# EAGLE design IO Board (EAGLE 5.12)

## Sheet 1 of 4
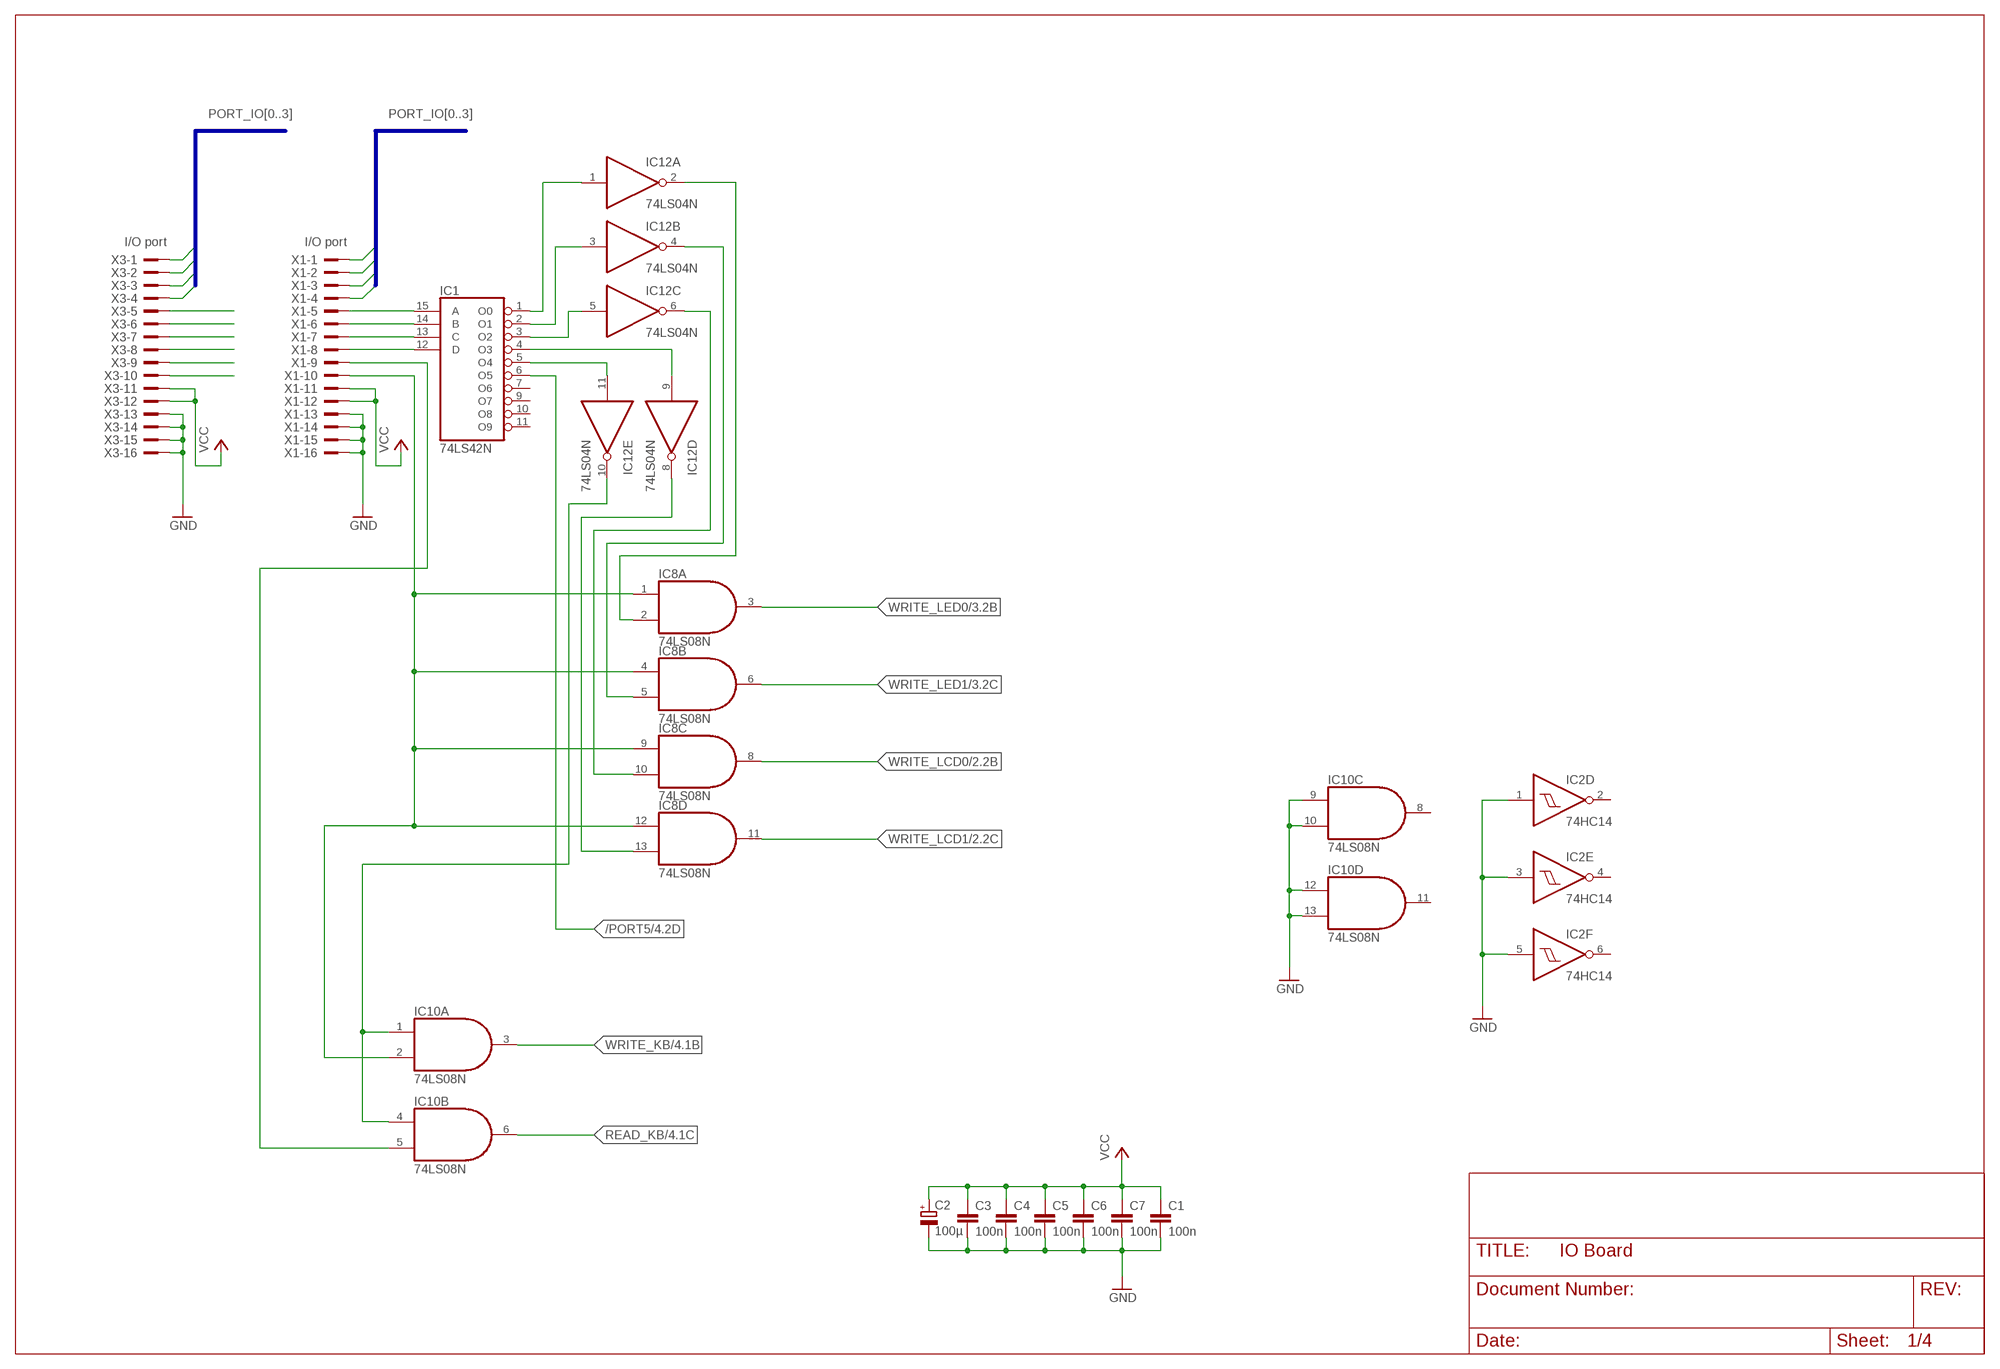
[diagram p0: schematic, sheet 1]

### Parts
C1  100n  C-EU050-025X075  [C050-025X075]
C2  100µ  CPOL-EUE2.5-6  [E2,5-6]
C3  100n  C-EU050-025X075  [C050-025X075]
C4  100n  C-EU050-025X075  [C050-025X075]
C5  100n  C-EU050-025X075  [C050-025X075]
C6  100n  C-EU050-025X075  [C050-025X075]
C7  100n  C-EU050-025X075  [C050-025X075]
IC1  74LS42N  [DIL16]
IC2  74HC14  74LS14N  [DIL14]
IC8  74LS08N  [DIL14]
IC10  74LS08N  [DIL14]
IC12  74LS04N  [DIL14]
X1  I/O port  2516-  [PAK100/2500-16]
X3  I/O port  2516-  [PAK100/2500-16]

### Nets
/PORT0: IC1.1(O0) IC12.1(A:I)
/PORT1: IC1.2(O1) IC12.3(B:I)
/PORT2: IC1.3(O2) IC12.5(C:I)
/PORT3: IC1.4(O3) IC12.9(D:I)
/PORT4: IC1.5(O4) IC12.11(E:I)
/PORT5: IC1.6(O5) ; also sheet 4
GND: C1.2 C2.- C3.2 C4.2 C5.2 C6.2 C7.2 IC2.1(D:I) IC2.3(E:I) IC2.5(F:I) IC10.9(C:I0) IC10.10(C:I1) IC10.12(D:I0) IC10.13(D:I1) X1.13 X1.14 X1.15 X1.16 X3.13 X3.14 X3.15 X3.16 ; also sheet 2,3,4
PORT0: IC8.2(A:I1) IC12.2(A:O)
PORT1: IC8.5(B:I1) IC12.4(B:O)
PORT2: IC8.10(C:I1) IC12.6(C:O)
PORT3: IC8.13(D:I1) IC12.8(D:O)
PORT4: IC10.1(A:I0) IC10.4(B:I0) IC12.10(E:O)
PORT_ADDR0: IC1.15(A) X1.5 X3.5
PORT_ADDR1: IC1.14(B) X1.6 X3.6
PORT_ADDR2: IC1.13(C) X1.7 X3.7
PORT_ADDR3: IC1.12(D) X1.8 X3.8
PORT_IO0: X1.1 X3.1 ; also sheet 2,3,4
PORT_IO1: X1.2 X3.2 ; also sheet 2,3,4
PORT_IO2: X1.3 X3.3 ; also sheet 2,3,4
PORT_IO3: X1.4 X3.4 ; also sheet 2,3,4
PORT_R: IC10.5(B:I1) X1.9 X3.9
PORT_W: IC8.1(A:I0) IC8.4(B:I0) IC8.9(C:I0) IC8.12(D:I0) IC10.2(A:I1) X1.10 X3.10
READ_KB: IC10.6(B:O) ; also sheet 4
VCC: C1.1 C2.+ C3.1 C4.1 C5.1 C6.1 C7.1 X1.11 X1.12 X3.11 X3.12 ; also sheet 2,3,4
WRITE_KB: IC10.3(A:O) ; also sheet 4
WRITE_LCD0: IC8.8(C:O) ; also sheet 2
WRITE_LCD1: IC8.11(D:O) ; also sheet 2
WRITE_LED0: IC8.3(A:O) ; also sheet 3
WRITE_LED1: IC8.6(B:O) ; also sheet 3
Unconnected: IC1.7(O6) IC1.9(O7) IC1.10(O8) IC1.11(O9) IC2.2(D:O) IC2.4(E:O) IC2.6(F:O) IC10.8(C:O) IC10.11(D:O)

### Buses
PORT_IO[0..3]

## Sheet 2 of 4
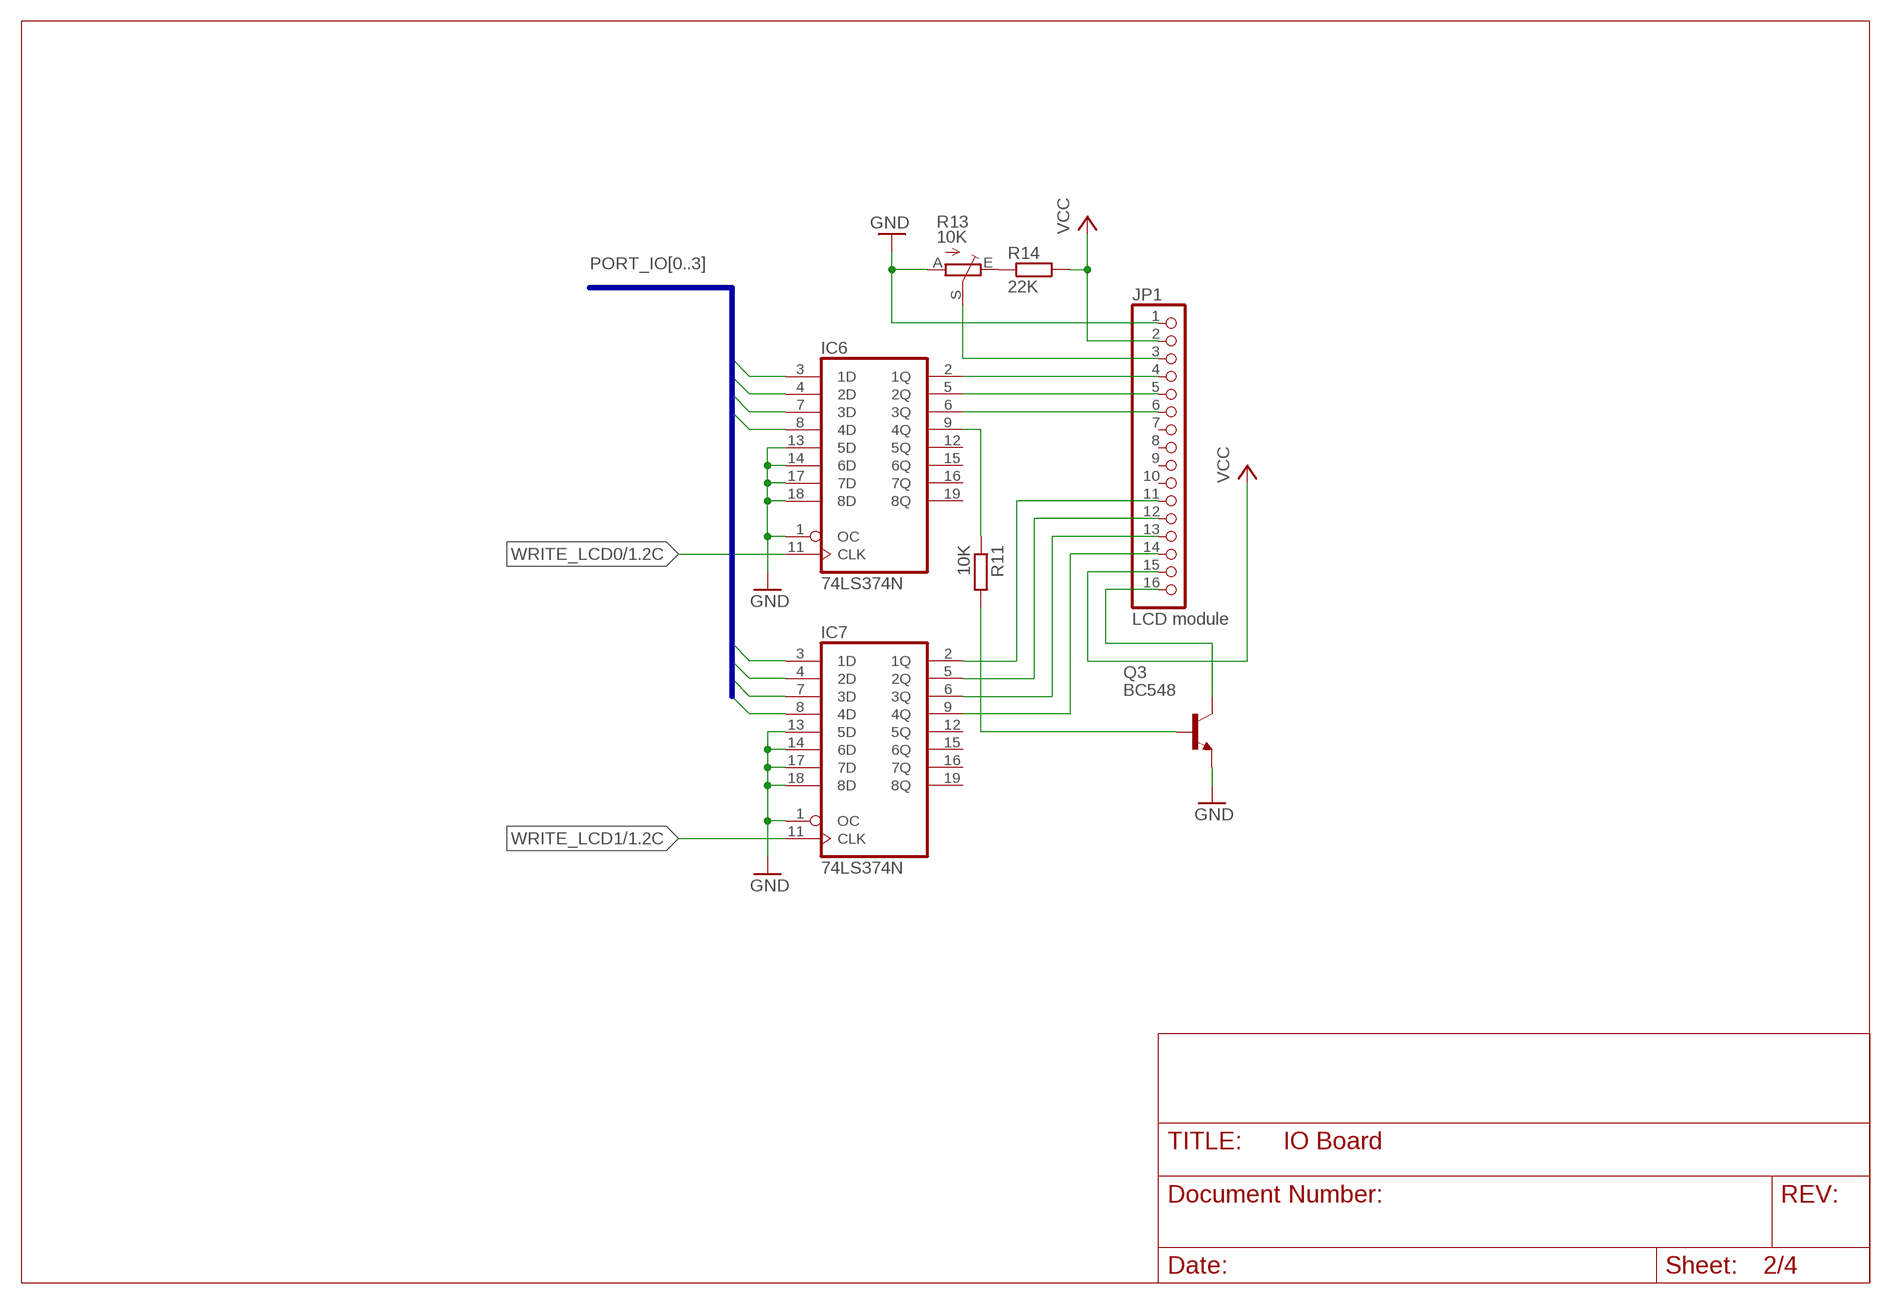
[diagram p1: schematic, sheet 2]

### Parts
IC6  74LS374N  [DIL20]
IC7  74LS374N  [DIL20]
JP1  LCD module  PINHD-1X16  [1X16]
Q3  BC548  [TO92-EBC]
R11  10K  R-EU_0207/10  [0207/10]
R13  10K  TRIM_EU-CA9V  [CA9V]
R14  22K  R-EU_0207/10  [0207/10]

### Nets
GND: IC6.1(OC) IC6.13(5D) IC6.14(6D) IC6.17(7D) IC6.18(8D) IC7.1(OC) IC7.13(5D) IC7.14(6D) IC7.17(7D) IC7.18(8D) JP1.1 Q3.E R13.A ; also sheet 1,3,4
LCD_CONTRAST: JP1.3 R13.S
LCD_D4: IC7.2(1Q) JP1.11
LCD_D5: IC7.5(2Q) JP1.12
LCD_D6: IC7.6(3Q) JP1.13
LCD_D7: IC7.9(4Q) JP1.14
LCD_E: IC6.6(3Q) JP1.6
LCD_RS: IC6.2(1Q) JP1.4
LCD_RW: IC6.5(2Q) JP1.5
N$11: R13.E R14.1
N$43: JP1.16 Q3.C
N$44: Q3.B R11.2
N$45: IC6.9(4Q) R11.1
PORT_IO0: IC6.3(1D) IC7.3(1D) ; also sheet 1,3,4
PORT_IO1: IC6.4(2D) IC7.4(2D) ; also sheet 1,3,4
PORT_IO2: IC6.7(3D) IC7.7(3D) ; also sheet 1,3,4
PORT_IO3: IC6.8(4D) IC7.8(4D) ; also sheet 1,3,4
VCC: JP1.2 JP1.15 R14.2 ; also sheet 1,3,4
WRITE_LCD0: IC6.11(CLK) ; also sheet 1
WRITE_LCD1: IC7.11(CLK) ; also sheet 1
Unconnected: IC6.12(5Q) IC6.15(6Q) IC6.16(7Q) IC6.19(8Q) IC7.12(5Q) IC7.15(6Q) IC7.16(7Q) IC7.19(8Q) JP1.7 JP1.8 JP1.9 JP1.10

### Buses
PORT_IO[0..3]

## Sheet 3 of 4
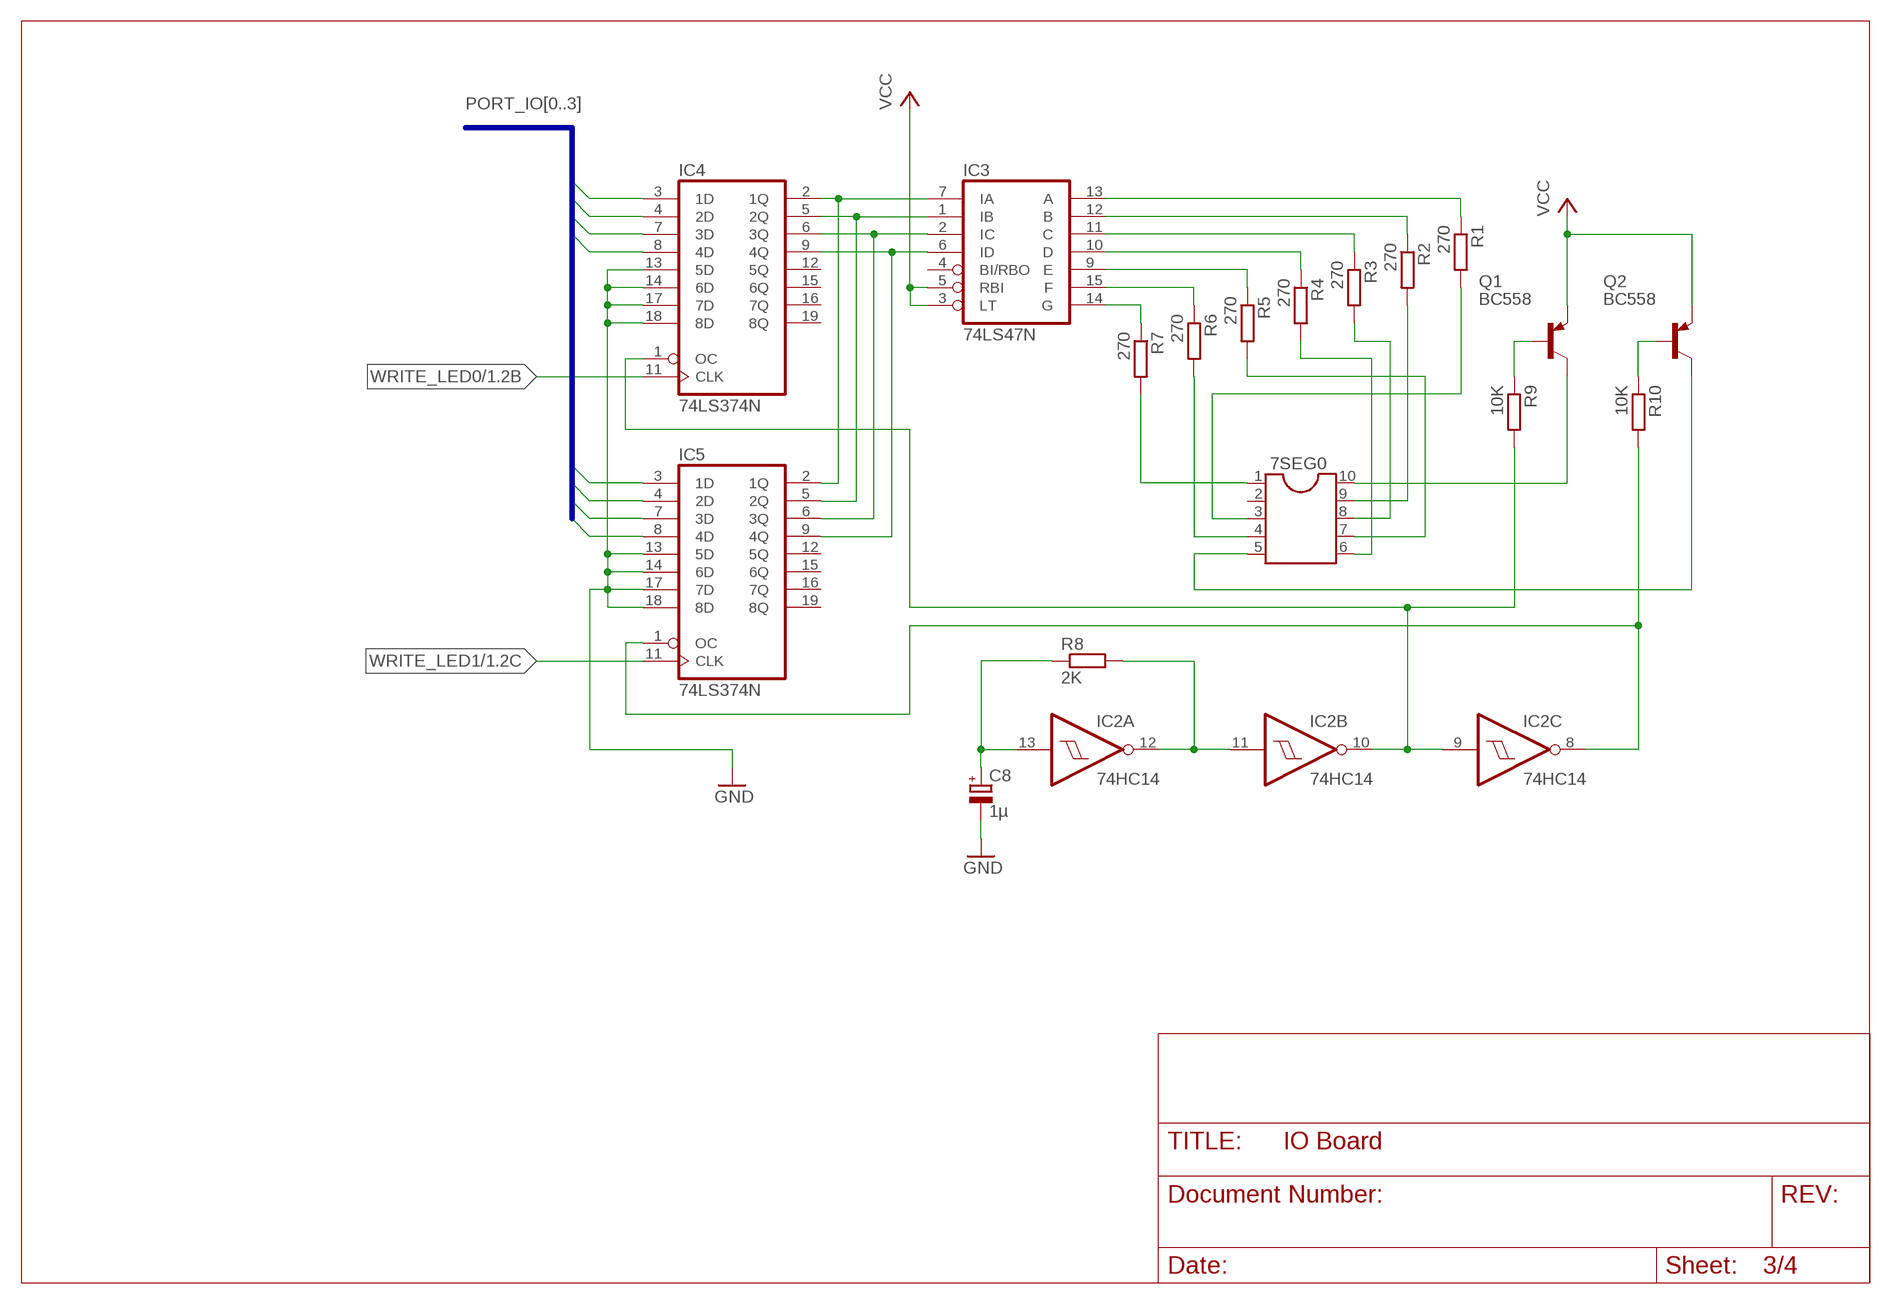
[diagram p2: schematic, sheet 3]

### Parts
7SEG0  DIL10  [DIL10]
C8  1µ  CPOL-EUE2.5-6  [E2,5-6]
IC3  74LS47N  [DIL16]
IC4  74LS374N  [DIL20]
IC5  74LS374N  [DIL20]
Q1  BC558  BC557  [TO92-EBC]
Q2  BC558  BC557  [TO92-EBC]
R1  270  R-EU_0207/10  [0207/10]
R2  270  R-EU_0207/10  [0207/10]
R3  270  R-EU_0207/10  [0207/10]
R4  270  R-EU_0207/10  [0207/10]
R5  270  R-EU_0207/10  [0207/10]
R6  270  R-EU_0207/10  [0207/10]
R7  270  R-EU_0207/10  [0207/10]
R8  2K  R-EU_0207/10  [0207/10]
R9  10K  R-EU_0207/10  [0207/10]
R10  10K  R-EU_0207/10  [0207/10]

### Nets
7SEG0: IC3.7(IA) IC4.2(1Q) IC5.2(1Q)
7SEG1: IC3.1(IB) IC4.5(2Q) IC5.5(2Q)
7SEG2: IC3.2(IC) IC4.6(3Q) IC5.6(3Q)
7SEG3: IC3.6(ID) IC4.9(4Q) IC5.9(4Q)
/EN_7SEG0: IC2.9(C:I) IC2.10(B:O) IC4.1(OC) R9.2
/EN_7SEG1: IC2.8(C:O) IC5.1(OC) R10.2
GND: C8.- IC4.13(5D) IC4.14(6D) IC4.17(7D) IC4.18(8D) IC5.13(5D) IC5.14(6D) IC5.17(7D) IC5.18(8D) ; also sheet 1,2,4
N$1: IC3.13(A) R1.1
N$2: IC3.12(B) R2.1
N$3: IC3.11(C) R3.1
N$4: IC3.10(D) R4.1
N$5: IC3.15(F) R6.1
N$6: IC3.14(G) R7.1
N$7: IC3.9(E) R5.1
N$8: IC2.11(B:I) IC2.12(A:O) R8.2
N$18: C8.+ IC2.13(A:I) R8.1
N$19: Q1.B R9.1
N$20: Q2.B R10.1
N$32: 7SEG0.10 Q1.C
N$33: 7SEG0.5 Q2.C
PORT_IO0: IC4.3(1D) IC5.3(1D) ; also sheet 1,2,4
PORT_IO1: IC4.4(2D) IC5.4(2D) ; also sheet 1,2,4
PORT_IO2: IC4.7(3D) IC5.7(3D) ; also sheet 1,2,4
PORT_IO3: IC4.8(4D) IC5.8(4D) ; also sheet 1,2,4
SEG_A: 7SEG0.3 R1.2
SEG_B: 7SEG0.9 R2.2
SEG_C: 7SEG0.8 R3.2
SEG_D: 7SEG0.6 R4.2
SEG_E: 7SEG0.7 R5.2
SEG_F: 7SEG0.4 R6.2
SEG_G: 7SEG0.1 R7.2
VCC: IC3.3(LT) IC3.5(RBI) Q1.E Q2.E ; also sheet 1,2,4
WRITE_LED0: IC4.11(CLK) ; also sheet 1
WRITE_LED1: IC5.11(CLK) ; also sheet 1
Unconnected: 7SEG0.2 IC3.4(BI/RBO) IC4.12(5Q) IC4.15(6Q) IC4.16(7Q) IC4.19(8Q) IC5.12(5Q) IC5.15(6Q) IC5.16(7Q) IC5.19(8Q)

### Buses
PORT_IO[0..3]

## Sheet 4 of 4
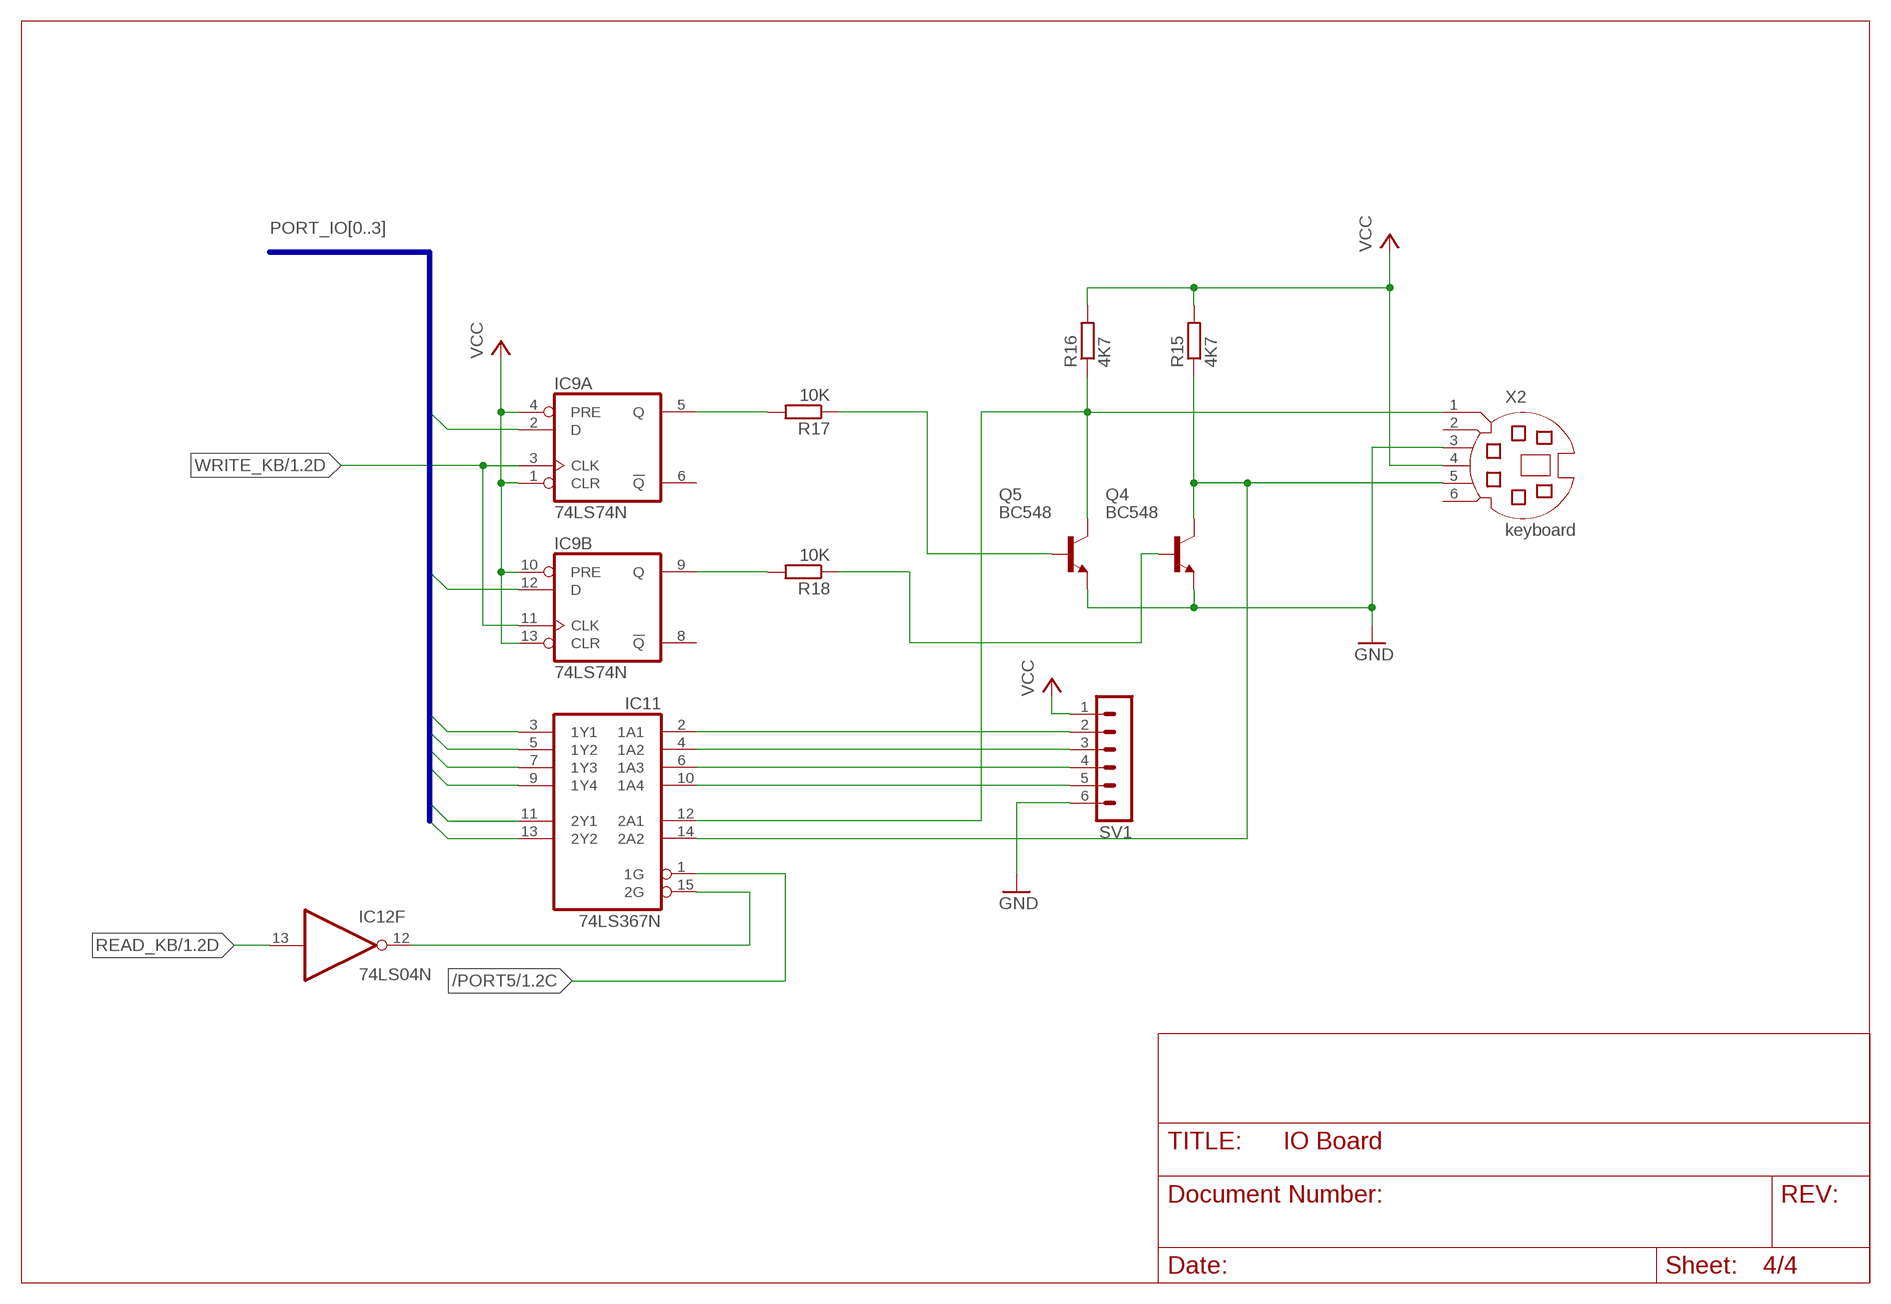
[diagram p3: schematic, sheet 4]

### Parts
IC9  74LS74N  [DIL14]
IC11  74LS367N  74367N  [DIL16]
Q4  BC548  [TO92-EBC]
Q5  BC548  [TO92-EBC]
R15  4K7  R-EU_0207/10  [0207/10]
R16  4K7  R-EU_0207/10  [0207/10]
R17  10K  R-EU_0207/10  [0207/10]
R18  10K  R-EU_0207/10  [0207/10]
SV1  MA06-1  [MA06-1]
X2  keyboard  MD06SS  [MDIN06SS]

### Nets
/PORT5: IC11.1(1G) ; also sheet 1
/READ_KB: IC11.15(2G) IC12.12(F:O)
GND: Q4.E Q5.E SV1.6 X2.3 ; also sheet 1,2,3
KB_CLK: IC11.14(2A2) Q4.C R15.1 X2.5
KB_DATA: IC11.12(2A1) Q5.C R16.1 X2.1
N$9: IC11.2(1A1) SV1.2
N$10: IC11.4(1A2) SV1.3
N$12: IC11.6(1A3) SV1.4
N$13: IC11.10(1A4) SV1.5
N$31: IC9.5(A:Q) R17.2
N$34: IC9.9(B:Q) R18.2
N$47: Q4.B R18.1
N$48: Q5.B R17.1
PORT_IO0: IC9.2(A:D) IC11.3(1Y1) IC11.11(2Y1) ; also sheet 1,2,3
PORT_IO1: IC9.12(B:D) IC11.5(1Y2) IC11.13(2Y2) ; also sheet 1,2,3
PORT_IO2: IC11.7(1Y3) ; also sheet 1,2,3
PORT_IO3: IC11.9(1Y4) ; also sheet 1,2,3
READ_KB: IC12.13(F:I) ; also sheet 1
VCC: IC9.1(A:CLR) IC9.4(A:PRE) IC9.10(B:PRE) IC9.13(B:CLR) R15.2 R16.2 SV1.1 X2.4 ; also sheet 1,2,3
WRITE_KB: IC9.3(A:CLK) IC9.11(B:CLK) ; also sheet 1
Unconnected: IC9.6(A:!Q) IC9.8(B:!Q) X2.2 X2.6

### Buses
PORT_IO[0..3]

## Power pins joined to a net without a drawn wire
GND: IC1.8(GND) IC2.7(P:GND) IC3.8(GND) IC4.10(GND) IC5.10(GND) IC6.10(GND) IC7.10(GND) IC8.7(P:GND) IC9.7(P:GND) IC10.7(P:GND) IC11.8(GND) IC12.7(P:GND)
VCC: IC1.16(VCC) IC2.14(P:VCC) IC3.16(VCC) IC4.20(VCC) IC5.20(VCC) IC6.20(VCC) IC7.20(VCC) IC8.14(P:VCC) IC9.14(P:VCC) IC10.14(P:VCC) IC11.16(VCC) IC12.14(P:VCC)

## Library data of the parts
7SEG0 = ic-package:DIL10: Dual In Line / Socket
C1 C3-C7 = rcl:C-EU: CAPACITOR, European symbol
C2 C8 = rcl:CPOL-EU: POLARIZED CAPACITOR, European symbol
IC1 = 74xx-us:74*42: 4-line to 10-line DECODER (1-of-10)
IC2 = 74xx-eu:74*14: Hex schmitt trigger INVERTER
IC3 = 74xx-us:74*47: BCD to seven segment DECODER/DRIVER Source: http://www.ee.washington.edu/stores/DataSheets/74ls/74ls47.pdf
IC4-IC7 = 74xx-us:74*374: Octal D type transparent LATCH, edge triggered
IC8 IC10 = 74xx-us:74*08: Quad 2-input AND gate
IC9 = 74xx-us:74*74: Dual D type positive edge triggered FLIP FLOP, preset and clear
IC11 = 74xx-us:74*367: Hex BUS DRIVER, 3-state
IC12 = 74xx-us:74*04: Hex INVERTER
JP1 = pinhead:PINHD-1X16: PIN HEADER
Q1 Q2 = transistor-pnp:BC557*: PNP Transistror
Q3-Q5 = transistor-npn:BC548*: NPN Transistor
R1-R11 R14-R18 = rcl:R-EU_: RESISTOR, European symbol
R13 = pot:TRIM_EU-: POTENTIOMETER
SV1 = con-lstb:MA06-1: PIN HEADER; OC_FARNELL: unknown; OC_NEWARK: unknown
X1 X3 = con-3m:2516-: 3M (TM) Pak 100 4-Wall Header Source: 3M; OC_FARNELL: unknown; OC_NEWARK: unknown
X2 = con-yamaichi:MD06SS: YAMAICHI CONNECTOR; OC_FARNELL: unknown; OC_NEWARK: unknown

## Board
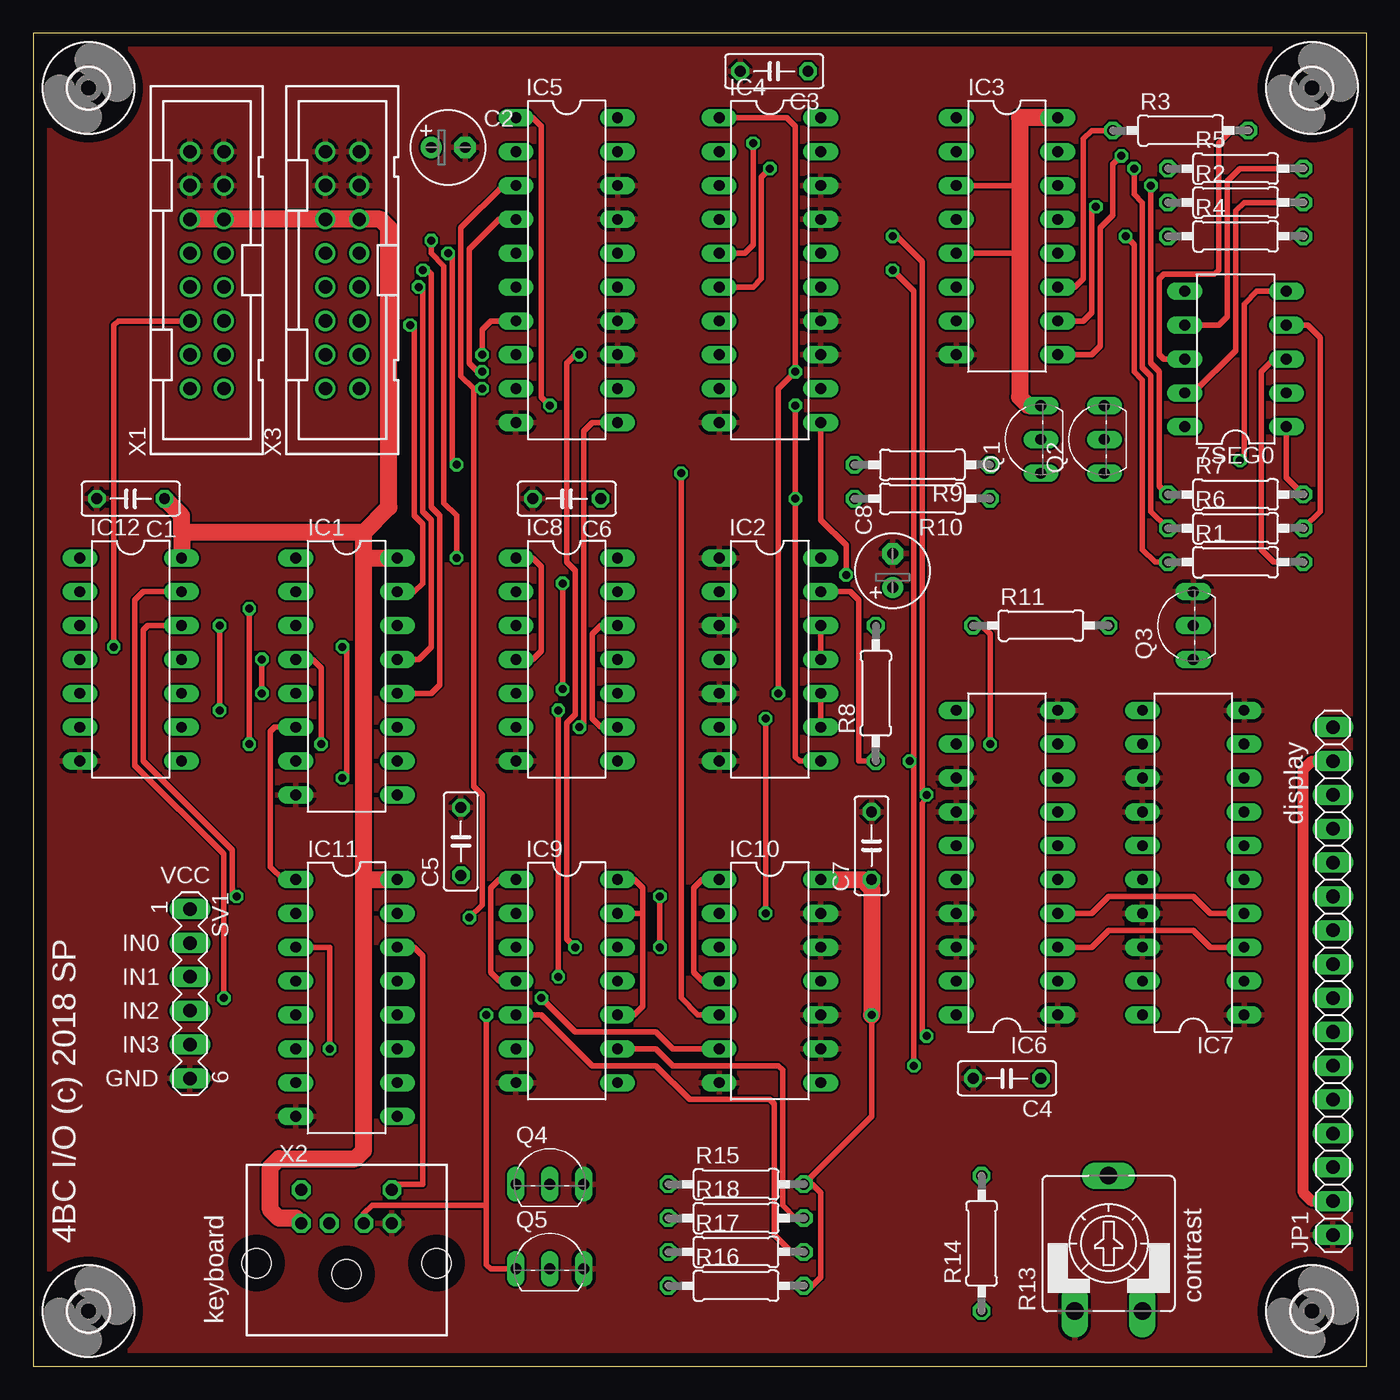
[diagram p4: board, top side]
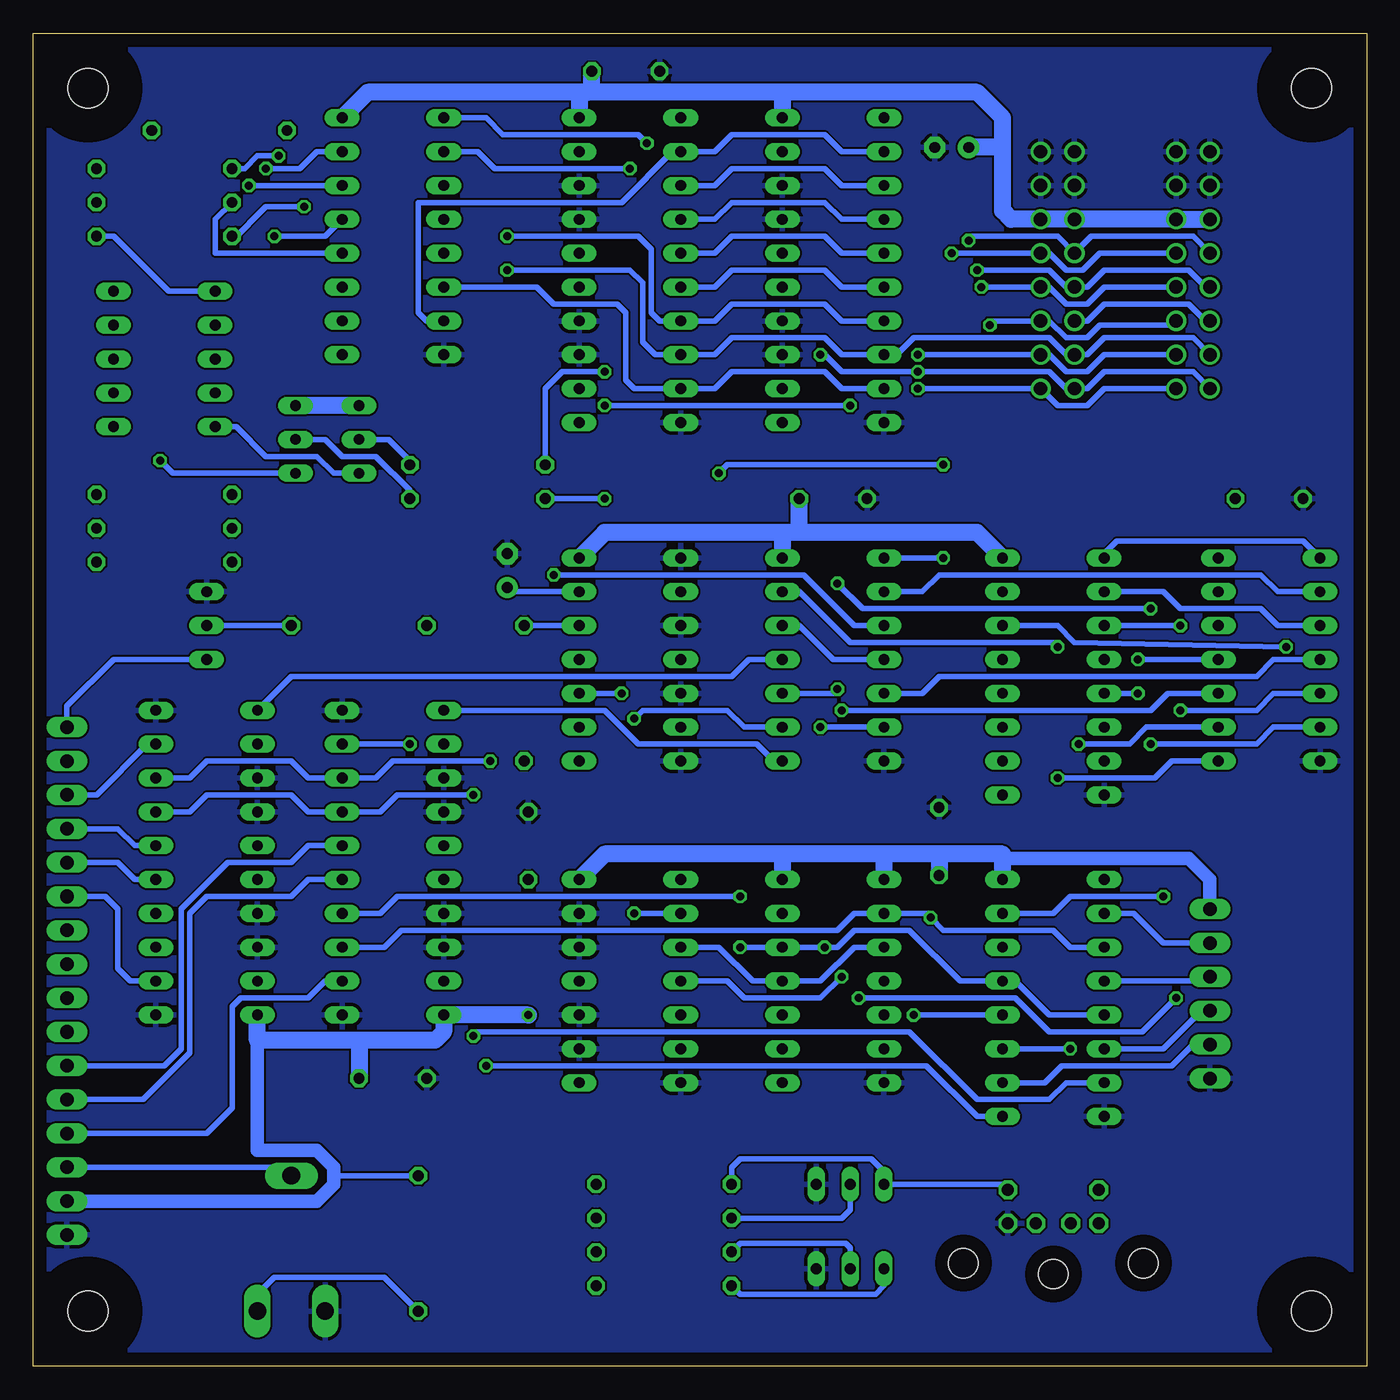
[diagram p5: board, bottom side, seen from below]

Size 99.99 x 100 mm. Coordinates in mm from the lower left corner, seen from the top.
Outline: 0,0 99.99,0 99.99,100 0,100 0,0
Copper layers (1*16): Top 0.035mm / dielectric 1.5mm / Bottom 0.035mm
Design rules "default *": minimum track width 10mil, minimum drill 16mil, track to track 6mil, track to pad 6mil, pad to pad 8mil, via to via 8mil, smd to smd 8mil, copper to edge 40mil, drill to drill 8mil, minimum pad ring 10mil, minimum via ring 8mil, stop-mask expansion 4mil, vias tented up to drill 0mil, thermal gap 10mil

### Footprints (pad centres in the part's own frame; a part is rotated, then mirrored left to right if it is on the bottom)
DIL10 = drill 0.813 long: 1 -5.08,-3.81; 2 -2.54,-3.81; 3 0,-3.81; 4 2.54,-3.81; 5 5.08,-3.81; 6 5.08,3.81; 7 2.54,3.81; 8 0,3.81; 9 -2.54,3.81; 10 -5.08,3.81
C050-025X075 = drill 0.813 octagon: 1 -2.54,0; 2 2.54,0
E2,5-6 = drill 0.813 pad 1.6 round: + -1.27,0 | drill 0.813 pad 1.6 octagon: - 1.27,0
DIL16 = drill 0.813 long: 1 -8.89,-3.81; 2 -6.35,-3.81; 3 -3.81,-3.81; 4 -1.27,-3.81; 5 1.27,-3.81; 6 3.81,-3.81; 7 6.35,-3.81; 8 8.89,-3.81; 9 8.89,3.81; 10 6.35,3.81; 11 3.81,3.81; 12 1.27,3.81; 13 -1.27,3.81; 14 -3.81,3.81; 15 -6.35,3.81; 16 -8.89,3.81
DIL14 = drill 0.813 long: 1 -7.62,-3.81; 2 -5.08,-3.81; 3 -2.54,-3.81; 4 0,-3.81; 5 2.54,-3.81; 6 5.08,-3.81; 7 7.62,-3.81; 8 7.62,3.81; 9 5.08,3.81; 10 2.54,3.81; 11 0,3.81; 12 -2.54,3.81; 13 -5.08,3.81; 14 -7.62,3.81
DIL20 = drill 0.813 long: 1 -11.43,-3.81; 2 -8.89,-3.81; 3 -6.35,-3.81; 4 -3.81,-3.81; 5 -1.27,-3.81; 6 1.27,-3.81; 7 3.81,-3.81; 8 6.35,-3.81; 9 8.89,-3.81; 10 11.43,-3.81; 11 11.43,3.81; 12 8.89,3.81; 13 6.35,3.81; 14 3.81,3.81; 15 1.27,3.81; 16 -1.27,3.81; 17 -3.81,3.81; 18 -6.35,3.81; 19 -8.89,3.81; 20 -11.43,3.81
1X16 = drill 1.016 long: 1 -19.05,0; 2 -16.51,0; 3 -13.97,0; 4 -11.43,0; 5 -8.89,0; 6 -6.35,0; 7 -3.81,0; 8 -1.27,0; 9 1.27,0; 10 3.81,0; 11 6.35,0; 12 8.89,0; 13 11.43,0; 14 13.97,0; 15 16.51,0; 16 19.05,0
TO92-EBC = drill 0.813 long: B 0,-1.27; C -2.54,-1.27; E 2.54,-1.27
0207/10 = drill 0.813 octagon: 1 -5.08,0; 2 5.08,0
CA9V = drill 1.321 long: A -2.54,-5.08; E 2.54,-5.08; S 0,5.08
MA06-1 = drill 1.016 long: 1 -6.35,0; 2 -3.81,0; 3 -1.27,0; 4 1.27,0; 5 3.81,0; 6 6.35,0
3,0 = hole 3: 0,0
PAK100/2500-16 = drill 1 pad 1.422 round: 1 -8.89,-1.27; 2 -8.89,1.27; 3 -6.35,-1.27; 4 -6.35,1.27; 5 -3.81,-1.27; 6 -3.81,1.27; 7 -1.27,-1.27; 8 -1.27,1.27; 9 1.27,-1.27; 10 1.27,1.27; 11 3.81,-1.27; 12 3.81,1.27; 13 6.35,-1.27; 14 6.35,1.27; 15 8.89,-1.27; 16 8.89,1.27
MDIN06SS = drill 0.9 octagon: 1 1.3,8.5; 2 -1.3,8.5; 3 3.4,8.5; 4 -3.4,8.5; 5 3.4,11; 6 -3.4,11 | hole 2.2: -6.75,5.5; 0,4.7; 6.75,5.5

### Placement (x,y rotation side)
7SEG0  90.17,75.56 90 top
C1  7.3,65.09 180 top
C2  31.11,91.44 0 top
C3  55.56,97.16 180 top
C4  73.03,21.59 180 top
C5  32.07,39.37 90 top
C6  40.01,65.09 180 top
C7  62.87,39.05 90 top
C8  64.45,59.69 90 top
IC1  23.5,51.75 270 top
IC2  55.24,53.02 270 top
IC3  73.03,84.77 270 top
IC4  55.24,82.23 270 top
IC5  40.01,82.23 270 top
IC6  73.03,37.78 90 top
IC7  87,37.78 90 top
IC8  40.01,53.02 270 top
IC9  40.01,28.89 270 top
IC10  55.24,28.89 270 top
IC11  23.5,27.62 270 top
IC12  7.3,53.02 270 top
JP1  97.47,28.89 90 top
Q1  74.3,69.53 90 top
Q2  79.06,69.53 90 top
Q3  85.72,55.56 90 top
Q4  38.73,14.92 0 top
Q5  38.73,8.57 0 top
R1  90.17,60.33 0 top
R2  90.17,87.31 0 top
R3  86.04,92.71 0 top
R4  90.17,84.77 0 top
R5  90.17,89.85 0 top
R6  90.17,62.87 0 top
R7  90.17,65.41 0 top
R8  63.18,50.48 90 top
R9  66.67,67.63 180 top
R10  66.67,65.09 180 top
R11  75.56,55.56 0 top
R13  80.64,9.21 0 top
R14  71.12,9.21 90 top
R15  52.7,13.65 0 top
R16  52.7,6.03 0 top
R17  52.7,8.57 0 top
R18  52.7,11.11 0 top
SV1  11.75,27.94 270 top
U$1  [3,0]  4.13,95.89 0 top
U$2  [3,0]  4.13,4.13 0 top
U$3  [3,0]  95.89,95.89 0 top
U$4  [3,0]  95.89,4.13 0 top
X1  13.02,82.23 90 top
X2  23.5,2.22 0 top
X3  23.18,82.23 90 top

### Tracks (layer width: path | path; a pad name or v marks a point on that pad's centre or on a via)
7SEG0
  Bottom 0.406: IC5.2 39.37,91.12 40.64,92.39 47.62,92.39 48.9,91.12 IC4.2 52.07,91.12 55.88,87.31 71.12,87.31 71.12,79.06 70.48,78.42 IC3.7
7SEG1  (via drill 0.6)
  Top 0.406: v53.98,91.76 53.98,84.14 53.34,83.5 IC4.5
  Bottom 0.406: IC5.5 39.37,83.5 40.64,84.77 47.62,84.77 48.9,83.5 IC4.5 | IC3.1 66.04,93.66 64.77,92.39 54.61,92.39 v53.98,91.76
7SEG2  (via drill 0.6)
  Top 0.406: v55.24,89.85 54.61,89.22 54.61,81.6 53.98,80.96 IC4.6
  Bottom 0.406: IC4.6 48.9,80.96 47.62,82.23 40.64,82.23 39.37,80.96 IC5.6 | IC3.2 66.67,91.12 65.41,89.85 v55.24,89.85
7SEG3
  Bottom 0.406: IC5.9 39.37,73.34 40.64,74.61 47.62,74.61 48.9,73.34 IC4.9 54.93,73.34 55.56,73.98 55.56,79.06 56.2,79.69 60.96,79.69 62.23,80.96 IC3.6
/EN_7SEG0  (via drill 0.6)
  Top 0.406: IC2.9 IC2.10 | v55.88,50.48 55.88,73.34 v57.15,74.61 57.15,93.03 56.52,93.66 IC4.1
  Bottom 0.406: v57.15,74.61 60.33,74.61 61.59,73.34 R9.2 | IC2.10 v55.88,50.48
/EN_7SEG1  (via drill 0.6)
  Top 0.406: IC5.1 37.47,93.66 38.1,93.03 38.1,72.71 v38.73,72.07 | IC2.8 57.47,45.4 57.15,45.72 v57.15,65.09 v57.15,72.07
  Bottom 0.406: v57.15,72.07 v38.73,72.07 | v57.15,65.09 R10.2
/PORT0
  Bottom 0.406: IC1.1 19.68,60.96 18.73,61.91 4.76,61.91 IC12.1
/PORT1
  Bottom 0.406: IC1.2 15.24,58.1 13.97,56.83 7.94,56.83 6.67,55.56 IC12.3
/PORT2  (via drill 0.6)
  Top 0.406: v13.97,49.21 v13.97,55.56
  Bottom 0.406: v13.97,55.56 IC1.3 | v13.97,49.21 8.26,49.21 6.99,50.48 IC12.5
/PORT3  (via drill 0.6)
  Top 0.406: v21.59,46.67 21.59,52.39 20.95,53.02 IC1.4
  Bottom 0.406: IC12.9 16.51,47.94 17.78,46.67 v21.59,46.67
/PORT4  (via drill 0.6)
  Top 0.406: v17.14,53.02 v17.14,50.48
  Bottom 0.406: v17.14,50.48 IC1.5 | IC12.11 v17.14,53.02
/PORT5
  Top 0.406: IC11.1 18.73,36.51 17.78,37.47 17.78,47.62 18.1,47.94 IC1.6
/READ_KB  (via drill 0.6)
  Top 0.406: v15.24,35.24 14.92,35.56 14.92,38.73 8.26,45.4 8.26,55.24 8.57,55.56 IC12.12
  Bottom 0.406: IC11.15 23.5,33.97 22.23,35.24 v15.24,35.24
GND
  pour Bottom: 0,100.01 100.65,100.01 100.65,0 0,0
  pour Top: 0,100.01 100.65,100.01 100.65,0 0,0
KB_CLK
  Top 0.406: IC11.14 28.57,31.43 29.21,30.8 29.21,13.65 27.32,13.65 X2.5
  Bottom 0.406: R15.1 47.62,14.92 46.99,15.56 37.15,15.56 36.2,14.61 Q4.C 27.32,13.65 X2.5
KB_DATA  (via drill 0.6)
  Top 0.406: 33.97,12.06 33.97,7.62 34.29,7.3 Q5.C | 33.97,12.06 v33.97,26.35 | X2.1 24.8,11.46 25.4,12.06 33.97,12.06
  Bottom 0.406: R16.1 46.99,5.4 36.83,5.4 36.2,6.03 Q5.C | v33.97,26.35 IC11.12
LCD_CONTRAST
  Bottom 0.406: JP1.3 81.28,14.92 R13.S
LCD_D4
  Bottom 0.406: JP1.11 94.61,35.24 93.66,34.29 93.66,29.84 92.71,28.89 IC7.2
LCD_D5
  Bottom 0.406: IC7.5 92.39,36.51 93.66,37.78 JP1.12
LCD_D6
  Bottom 0.406: IC7.6 92.39,39.05 93.66,40.32 JP1.13
LCD_D7
  Bottom 0.406: JP1.14 95.25,42.86 91.44,46.67 IC7.9
LCD_E
  Bottom 0.406: IC6.6 79.38,39.05 80.64,37.78 85.41,37.78 88.9,34.29 88.9,23.81 90.17,22.54 JP1.6
LCD_RS
  Bottom 0.406: IC6.2 78.11,28.89 79.38,27.62 84.45,27.62 85.09,26.99 85.09,19.37 87,17.46 JP1.4
LCD_RW
  Bottom 0.406: JP1.5 91.76,20 88.27,23.5 88.27,33.97 87,35.24 80.64,35.24 79.38,36.51 IC6.5
N$1  (via drill 0.6)
  Top 0.406: R1.1 84.14,60.33 83.19,61.28 83.19,73.98 82.55,74.61 82.55,84.14 v81.92,84.77
  Bottom 0.406: v81.92,84.77 78.11,84.77 IC3.13
N$2
  Bottom 0.406: IC3.12 86.36,83.5 86.36,86.04 R2.1
N$3
  Top 0.406: R3.1 79.38,92.71 78.74,92.08 78.74,81.6 78.11,80.96 IC3.11
N$4  (via drill 0.6)
  Top 0.406: v79.69,87 79.38,86.68 79.38,79.06 78.74,78.42 IC3.10
  Bottom 0.406: v79.69,87 82.55,87 85.09,84.45 R4.1
N$5  (via drill 0.6)
  Top 0.406: R6.1 83.82,64.14 83.82,74.3 83.19,74.93 83.19,87.31 82.55,87.95 v82.55,89.85
  Bottom 0.406: v82.55,89.85 80.01,89.85 78.74,91.12 IC3.15
N$6  (via drill 0.6)
  Top 0.406: R7.1 84.45,66.04 84.45,74.61 83.82,75.25 v83.82,88.58
  Bottom 0.406: v83.82,88.58 IC3.14
N$7  (via drill 0.6)
  Top 0.406: IC3.9 79.38,75.88 80.01,76.52 80.01,85.41 80.96,86.36 80.96,90.17 v81.6,90.81
  Bottom 0.406: v81.6,90.81 83.19,90.81 84.14,89.85 R5.1
N$8
  Top 0.406: IC2.11 IC2.12
  Bottom 0.406: IC2.12 R8.2
N$9
  Bottom 0.406: IC11.2 17.46,33.97 15.24,31.75 SV1.2
N$10
  Bottom 0.406: IC11.4 12.38,28.89 SV1.3
N$11
  Bottom 0.406: R13.E 83.19,5.4 81.92,6.67 73.66,6.67 R14.1
N$12
  Bottom 0.406: IC11.6 15.24,23.81 12.38,26.67 SV1.4
N$13
  Bottom 0.406: IC11.10 24.13,21.27 22.86,22.54 14.61,22.54 13.02,24.13 SV1.5
N$18
  Top 0.406: IC2.13 61.28,58.1 61.91,57.47 61.91,45.4 R8.1
  Bottom 0.406: C8.+ 64.14,58.1 IC2.13
N$19
  Bottom 0.406: R9.1 71.75,67.94 73.34,69.53 Q1.B
N$20
  Bottom 0.406: Q2.B 78.11,69.53 76.83,68.26 74.3,68.26 71.75,65.72 R10.1
N$31
  Top 0.406: R17.2 56.83,8.57 55.56,9.84 55.56,19.68 55.24,20 49.21,20 46.67,22.54 41.91,22.54 38.1,26.35 IC9.5
N$32
  Bottom 0.406: Q1.C 77.47,66.99 78.74,68.26 82.55,68.26 84.77,70.48 7SEG0.10
N$33  (via drill 0.6)
  Top 0.406: v90.49,67.94 90.81,68.26 90.81,79.69 91.76,80.64 7SEG0.5
  Bottom 0.406: Q2.C 89.53,66.99 v90.49,67.94
N$34
  Top 0.406: IC9.9 46.67,23.81 47.94,22.54 55.88,22.54 56.2,22.23 56.2,12.06 57.15,11.11 R18.2
N$43
  Bottom 0.406: JP1.16 97.47,49.53 93.98,53.02 Q3.C
N$44
  Bottom 0.406: R11.2 Q3.B
N$45  (via drill 0.6)
  Top 0.406: v71.75,46.67 71.75,54.93 71.12,55.56 R11.1
  Bottom 0.406: v71.75,46.67 IC6.9
N$47
  Bottom 0.406: R18.1 39.37,11.11 38.73,11.75 Q4.B
N$48
  Bottom 0.406: Q5.B 38.73,8.89 39.05,9.21 46.99,9.21 R17.1
PORT0
  Bottom 0.406: IC8.2 33.34,58.1 32.07,59.37 7.94,59.37 6.67,58.1 IC12.2
PORT1
  Bottom 0.406: IC8.5 33.34,50.48 32.07,51.75 8.26,51.75 6.99,53.02 IC12.4
PORT2  (via drill 0.6)
  Top 0.406: v39.69,58.74 v39.69,50.8 | v16.19,46.67 v16.19,56.83
  Bottom 0.406: v39.69,58.74 37.78,56.83 v16.19,56.83 | v39.69,50.8 40.01,50.48 IC8.10 | v16.19,46.67 8.26,46.67 6.99,47.94 IC12.6
PORT3  (via drill 0.6)
  Top 0.406: v23.18,44.13 23.5,44.45 23.5,53.66 v23.18,53.98
  Bottom 0.406: IC8.13 42.55,58.1 38.73,54.29 23.5,54.29 v23.18,53.98 | v23.18,44.13 15.88,44.13 14.61,45.4 IC12.8
PORT4  (via drill 0.6)
  Top 0.406: IC10.4 50.16,28.89 49.53,29.53 49.53,35.88 50.16,36.51 IC10.1 | v39.37,49.21 v39.37,29.21
  Bottom 0.406: v39.37,29.21 40.96,27.62 46.67,27.62 47.94,28.89 IC10.4 | v39.37,49.21 16.19,49.21 14.92,50.48 IC12.10
PORT_ADDR0  (via drill 0.6)
  Top 0.406: IC1.15 28.57,58.1 29.21,58.74 29.21,63.18 28.57,63.82 28.57,77.79 v28.26,78.11
  Bottom 0.406: X1.5 14.61,78.11 20,78.11 20.95,77.15 22.54,77.15 23.81,78.42 X3.5 27.94,78.42 v28.26,78.11
PORT_ADDR1  (via drill 0.6)
  Top 0.406: v6.03,53.98 6.03,78.11 6.35,78.42 X1.6
  Bottom 0.406: IC1.14 23.18,55.56 21.91,54.29 v6.03,53.98 | X1.6 12.06,78.42 13.34,79.69 19.68,79.69 20.95,78.42 X3.6
PORT_ADDR2  (via drill 0.6)
  Top 0.406: IC1.13 28.89,53.02 29.84,53.98 29.84,63.5 29.21,64.14 29.21,80.64 v28.89,80.96
  Bottom 0.406: X1.7 19.68,80.96 20.95,79.69 22.54,79.69 23.81,80.96 X3.7 v28.89,80.96
PORT_ADDR3  (via drill 0.6)
  Top 0.406: v29.21,82.23 29.53,82.23 29.84,81.92 29.84,64.45 30.48,63.82 30.48,51.12 29.84,50.48 IC1.12
  Bottom 0.406: X1.8 12.06,80.96 13.34,82.23 19.68,82.23 20.95,80.96 X3.8 22.54,80.96 23.81,82.23 v29.21,82.23
PORT_IO0  (via drill 0.6)
  Top 0.406: IC7.3 88.27,31.43 87,32.7 80.64,32.7 79.38,31.43 IC6.3 | 33.02,73.34 v33.66,73.34 | 33.02,73.34 32.07,74.3 32.07,85.41 35.24,88.58 IC5.3 | v22.23,23.81 22.23,31.43 IC11.3 | 33.02,73.34 33.02,43.5 33.66,42.86 33.66,34.61 v32.7,33.66
  Bottom 0.406: IC4.3 48.9,88.58 47.62,89.85 40.64,89.85 39.37,88.58 IC5.3 | IC6.3 73.66,31.43 72.39,32.7 39.69,32.7 38.42,33.97 IC9.2 33.02,33.97 v32.7,33.66 31.75,32.7 23.5,32.7 22.23,31.43 IC11.3 | v22.23,23.81 IC11.11 | X1.1 19.68,73.34 20.95,72.07 23.18,72.07 X3.1 v33.66,73.34
PORT_IO1  (via drill 0.6)
  Top 0.406: IC7.4 88.27,33.97 87,35.24 80.64,35.24 79.38,33.97 IC6.4 | v46.99,31.43 v46.99,35.24 | v33.66,74.61 33.34,74.61 32.7,75.25 32.7,83.82 34.92,86.04 IC5.4 | v40.96,75.88 40.64,75.88 40.01,75.25 40.01,60.33 40.64,59.69 40.64,48.9 40.01,48.26 40.01,32.07 v40.64,31.43
  Bottom 0.406: IC4.4 48.9,86.04 47.62,87.31 40.64,87.31 39.37,86.04 IC5.4 | IC6.4 73.98,33.97 72.71,35.24 v46.99,35.24 | v46.99,31.43 IC9.12 v40.64,31.43 39.69,31.43 38.42,32.7 34.29,32.7 30.48,28.89 IC11.13 26.35,28.89 23.81,26.35 IC11.5 | X1.2 13.02,74.61 19.68,74.61 20.95,73.34 X3.2 22.54,73.34 23.81,74.61 v33.66,74.61 39.37,74.61 40.64,75.88 v40.96,75.88
PORT_IO2  (via drill 0.6)
  Top 0.406: v33.66,75.88 33.66,77.79 34.29,78.42 IC5.7 | v64.45,84.77 64.77,84.77 66.67,82.87 66.67,43.18 v66.99,42.86 66.67,42.23 66.67,25.08 v66.99,24.77
  Bottom 0.406: IC5.7 39.37,78.42 40.64,79.69 47.62,79.69 48.9,78.42 IC4.7 53.02,78.42 53.66,79.06 53.66,83.82 54.61,84.77 v64.45,84.77 | IC7.7 88.27,41.59 87,42.86 80.64,42.86 79.38,41.59 IC6.7 73.98,41.59 72.71,42.86 v66.99,42.86 | IC11.7 22.54,21.27 23.81,20 29.21,20 34.29,25.08 66.67,25.08 v66.99,24.77 | X1.3 19.68,75.88 20.95,74.61 22.54,74.61 23.81,75.88 X3.3 v33.66,75.88
PORT_IO3  (via drill 0.6)
  Top 0.406: v64.45,82.23 66.04,80.64 66.04,45.72 v65.72,45.4 66.04,45.09 v66.04,22.54
  Bottom 0.406: IC7.8 88.27,44.13 87,45.4 80.64,45.4 79.38,44.13 IC6.8 74.3,44.13 73.03,45.4 v65.72,45.4 | X1.4 13.02,77.15 19.68,77.15 20.95,75.88 X3.4 22.54,75.88 23.81,77.15 33.97,77.15 35.24,75.88 IC5.8 39.37,75.88 40.64,77.15 47.62,77.15 48.9,75.88 IC4.8 53.34,75.88 54.29,76.83 54.29,81.28 55.24,82.23 v64.45,82.23 | IC11.9 29.21,18.73 33.02,22.54 v66.04,22.54
PORT_R  (via drill 0.6)
  Top 0.406: v31.11,83.5 31.43,83.19 31.43,67.94 v31.75,67.63 | v48.58,66.99 48.58,27.62 49.85,26.35 IC10.5
  Bottom 0.406: v31.75,67.63 47.94,67.63 v48.58,66.99 | X1.9 20,83.5 21.27,82.23 22.54,82.23 23.81,83.5 X3.9 v31.11,83.5
PORT_W  (via drill 0.6)
  Top 0.406: IC8.12 42.55,55.56 41.91,54.93 41.91,48.58 42.55,47.94 IC8.9 | IC8.4 37.47,53.02 38.1,53.66 38.1,60.01 37.47,60.64 IC8.1 | v54.93,33.97 v54.93,48.58 | v31.75,60.64 31.75,63.82 30.8,64.77 30.8,82.55 29.84,83.5 v29.84,84.45
  Bottom 0.406: IC8.4 40.01,53.02 42.55,55.56 IC8.12 | IC8.9 46.67,47.94 47.94,49.21 54.29,49.21 v54.93,48.58 | IC10.2 v54.93,33.97 | IC8.1 v31.75,60.64 | X1.10 13.02,84.77 20.64,84.77 X3.10 23.18,84.77 29.53,84.77 v29.84,84.45
READ_KB  (via drill 0.6)
  Top 0.406: IC10.6 47.94,23.81 46.67,25.08 40.64,25.08 v38.1,27.62 | v14.29,27.62 14.29,38.42 7.62,45.09 7.62,57.47 8.26,58.1 IC12.13
  Bottom 0.406: v38.1,27.62 26.35,27.62 23.81,25.08 16.83,25.08 v14.29,27.62
SEG_A
  Top 0.406: 7SEG0.3 93.03,75.56 92.08,74.61 92.08,61.28 93.03,60.33 R1.2
SEG_B
  Top 0.406: 7SEG0.9 87,73.03 90.17,76.2 90.17,86.68 90.81,87.31 R2.2
SEG_C
  Top 0.406: 7SEG0.8 84.77,75.56 84.45,75.88 84.45,81.6 84.77,81.92 88.58,81.92 88.9,82.23 88.9,91.76 89.85,92.71 R3.2
SEG_D
  Bottom 0.406: 7SEG0.6 89.85,80.64 93.98,84.77 R4.2
SEG_E
  Top 0.406: R5.2 90.49,89.85 89.53,88.9 89.53,78.74 88.9,78.11 7SEG0.7
SEG_F
  Top 0.406: R6.2 96.52,64.14 96.52,77.15 95.57,78.11 7SEG0.4
SEG_G
  Top 0.406: 7SEG0.1 93.98,66.67 R7.2
VCC  (via drill 0.6)
  Top 0.406: IC9.10 45.09,26.35 45.72,26.99 45.72,33.97 | 45.72,33.97 45.72,35.88 45.09,36.51 IC9.14 | 45.72,33.97 IC9.13 | IC9.1 34.92,36.51 34.29,35.88 34.29,29.53 34.92,28.89 IC9.4 | R16.2 58.42,6.03 59.05,6.67 59.05,13.02 58.42,13.65 R15.2 62.87,18.73 v62.87,26.35 | 73.98,83.5 IC3.5 | 73.98,88.58 IC3.3
  Top 0.813: JP1.15 95.89,45.4 95.25,44.77 95.25,13.02 95.89,12.38 JP1.2
  Top 1.27: Q1.E 74.61,72.07 73.98,72.71 73.98,83.5 73.98,88.58 73.98,93.66 IC3.16 | 24.77,62.55 26.67,64.45 26.67,85.41 26.04,86.04 X1.11 X1.12 | 24.77,60.64 IC1.16 | 24.77,36.51 24.77,60.64 | 24.77,36.51 IC11.16 | v62.87,26.35 62.87,35.88 62.71,36.04 | 62.71,36.04 62.23,36.51 IC10.14 | 24.77,36.51 24.77,16.19 24.13,15.56 18.41,15.56 17.78,14.92 17.78,11.75 18.41,11.11 19.7,11.11 X2.4 | C7.1 62.87,36.2 62.71,36.04 | 11.11,62.55 IC12.14 | 11.11,62.55 11.11,63.82 C1.1 | 24.77,60.64 24.77,62.55 | 24.77,62.55 11.11,62.55
  Bottom 0.406: 46.99,62.55 47.31,62.87 | R14.2 77.15,14.29 77.47,14.92
  Bottom 1.016: JP1.2 78.74,12.38 77.47,13.65 77.47,14.92 78.74,16.19 83.19,16.19 83.19,24.77 | SV1.1 11.75,36.51 13.34,38.1 27.3,38.1
  Bottom 1.27: 43.81,95.57 IC5.20 | 43.81,95.57 58.42,95.57 | 58.42,95.57 59.05,95.57 | 59.05,95.57 IC4.20 | 59.05,95.57 74.93,95.57 IC3.16 | X1.12 X1.11 X3.12 X3.11 26.67,86.04 27.3,86.68 27.3,91.44 | 27.3,91.44 27.3,93.66 29.21,95.57 43.81,95.57 | Q1.E Q2.E | IC11.16 27.3,38.1 27.3,38.42 31.75,38.42 | 31.75,38.42 36.2,38.42 | 36.2,38.42 IC9.1 | 36.2,38.42 43.81,38.42 | 43.81,38.42 IC9.14 | 43.81,38.42 57.15,38.42 IC10.14 | IC1.16 29.21,62.55 42.55,62.55 | 42.55,62.55 43.81,62.55 | 43.81,62.55 IC8.14 | 43.81,62.55 46.99,62.55 57.15,62.55 IC2.14 | IC7.20 83.19,24.77 83.19,24.45 75.56,24.45 | 75.56,24.45 69.85,24.45 69.22,25.08 IC6.20 v62.87,26.35 | C5.1 32.07,38.1 31.75,38.42 | 75.56,24.45 C4.1 | C3.1 58.1,95.89 58.42,95.57 | 27.3,91.44 C2.+ | 42.55,62.55 C6.1
WRITE_KB
  Bottom 0.406: IC9.3 38.42,31.43 40.96,28.89 IC9.11 46.04,28.89 48.58,31.43 IC10.3
WRITE_LCD0
  Bottom 0.406: IC6.11 57.15,49.21 54.61,46.67 45.72,46.67 44.45,45.4 IC8.8
WRITE_LCD1
  Bottom 0.406: IC8.11 46.35,53.02 47.62,51.75 80.64,51.75 IC7.11
WRITE_LED0  (via drill 0.6)
  Top 0.406: v60.96,59.37 60.96,61.59 59.05,63.5 IC4.11
  Bottom 0.406: IC8.3 38.42,55.56 42.23,59.37 v60.96,59.37
WRITE_LED1  (via drill 0.6)
  Top 0.406: IC5.11 41.91,70.8 41.27,70.17 41.27,48.26 v40.96,47.94
  Bottom 0.406: IC8.6 v40.96,47.94

### Text on the board
tNames: display | VCC | IN0 | IN1 | IN2 | IN3 | GND | 4BC I/O (c) 2018 SP | contrast | keyboard